# EAGLE design PCB-SSB-1x2 (EAGLE 7.1.0)
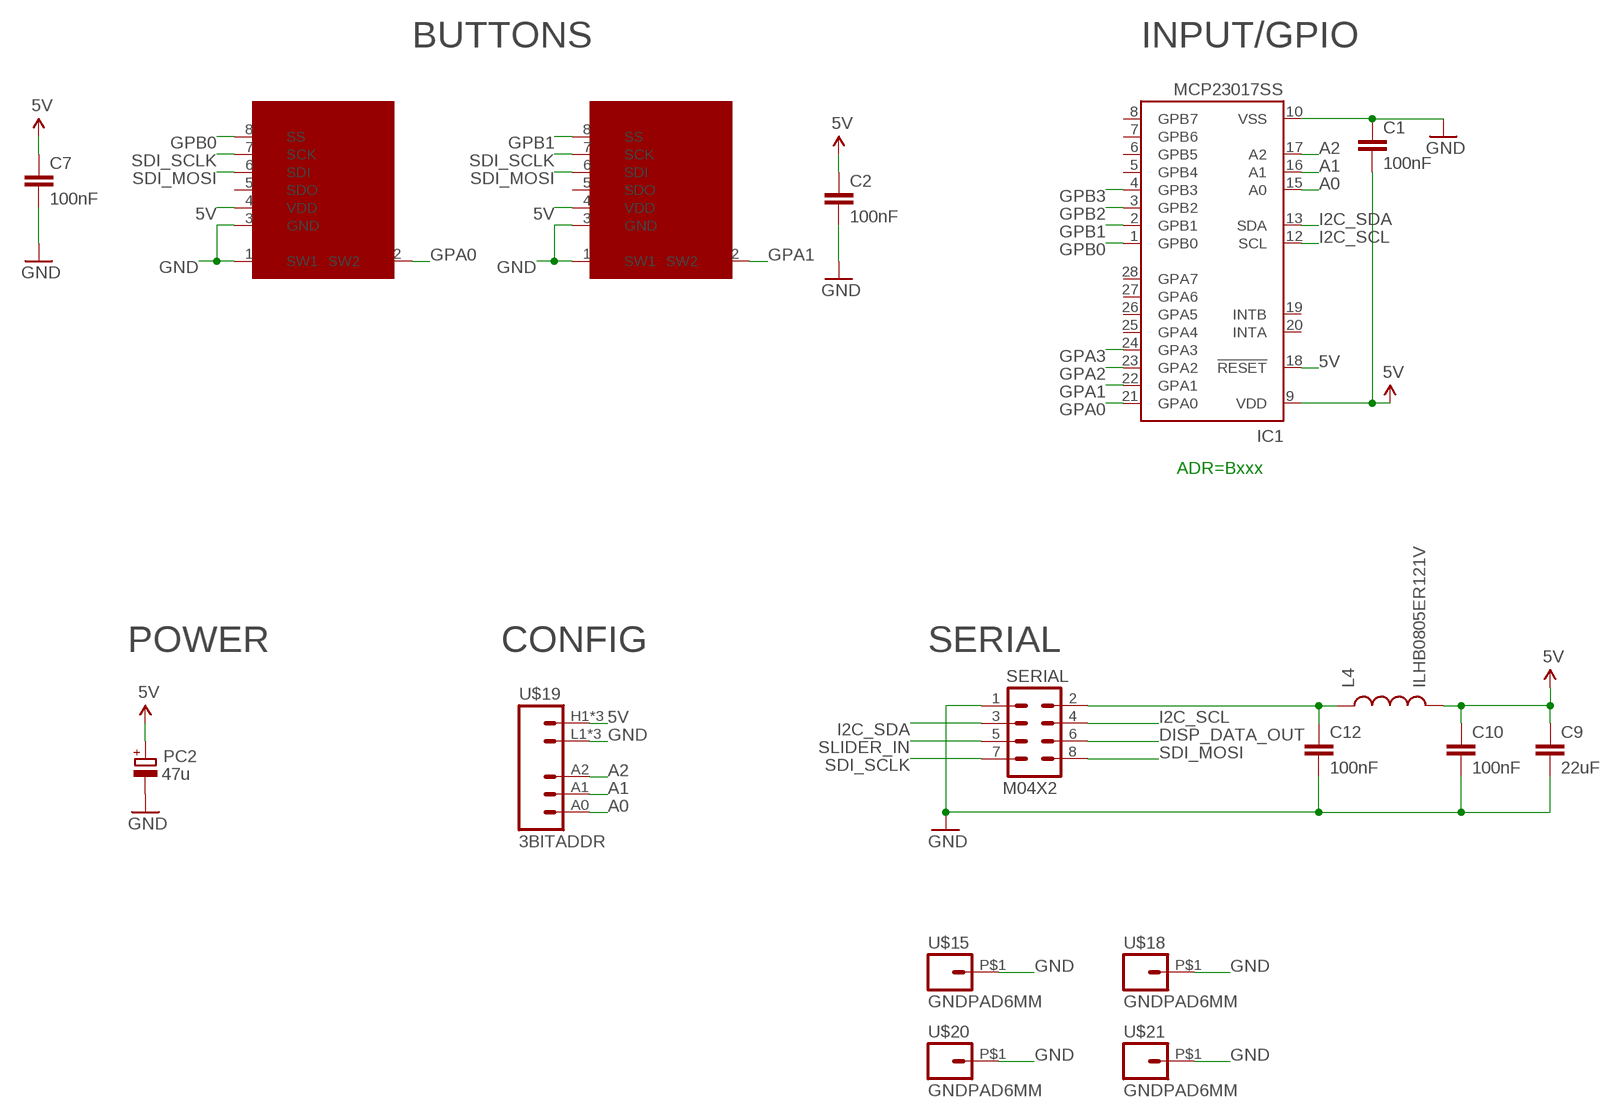
[diagram p0: schematic, sheet 1]

## Parts
C1  100nF  CAP0603-CAP  [0603-CAP]
C2  100nF  CAP0603-CAP  [0603-CAP]
C7  100nF  CAP0603-CAP  [0603-CAP]
C9  22uF  CAP0805  [0805]
C10  100nF  CAP0603-CAP  [0603-CAP]
C12  100nF  CAP0603-CAP  [0603-CAP]
IC1  MCP23017SS  [SSOP28]
L4  ILHB0805ER121V  INDUCTOR0805  [0805]
PC2  47u  CPOL-EUD  [PANASONIC_D]
SERIAL  M04X2  [2X4]
SSW1  SMART_SWITCHSMART_SWITCH_8PIN  [SMART_SWITCH]
SSW2  SMART_SWITCHSMART_SWITCH_8PIN  [SMART_SWITCH]
U$15  GNDPAD6MM  [3.2MMPAD6MM]
U$18  GNDPAD6MM  [3.2MMPAD6MM]
U$19  3BITADDR  [3BITADDR]
U$20  GNDPAD6MM  [3.2MMPAD6MM]
U$21  GNDPAD6MM  [3.2MMPAD6MM]

## Nets
5V [Power]: C1.2 C2.1 C7.1 C9.1 C10.1 IC1.9(VDD) IC1.18(!RESET) L4.2 PC2.+ SSW1.4(VDD) SSW2.4(VDD) U$19.H1(VCC) U$19.H2(VCC) U$19.H3(VCC)
A0: IC1.15(A0) U$19.A0
A1: IC1.16(A1) U$19.A1
A2: IC1.17(A2) U$19.A2
ARD_5V [Power]: C12.1 L4.1 SERIAL.2
DISP_DATA_OUT: SERIAL.6
GND [Power]: C1.1 C2.2 C7.2 C9.2 C10.2 C12.2 IC1.10(VSS) PC2.- SERIAL.1 SSW1.1(SW1) SSW1.3(GND) SSW2.1(SW1) SSW2.3(GND) U$15.P$1 U$18.P$1 U$19.L1(GND) U$19.L2(GND) U$19.L3(GND) U$20.P$1 U$21.P$1
GPA0: IC1.21(GPA0) SSW1.2(SW2)
GPA1: IC1.22(GPA1) SSW2.2(SW2)
GPA2: IC1.23(GPA2)
GPA3: IC1.24(GPA3)
GPB0: IC1.1(GPB0) SSW1.8(SS)
GPB1: IC1.2(GPB1) SSW2.8(SS)
GPB2: IC1.3(GPB2)
GPB3: IC1.4(GPB3)
I2C_SCL: IC1.12(SCL) SERIAL.4
I2C_SDA: IC1.13(SDA) SERIAL.3
SDI_MOSI: SERIAL.8 SSW1.6(SDI) SSW2.6(SDI)
SDI_SCLK: SERIAL.7 SSW1.7(SCK) SSW2.7(SCK)
SLIDER_IN: SERIAL.5
Unconnected: IC1.5(GPB4) IC1.6(GPB5) IC1.7(GPB6) IC1.8(GPB7) IC1.19(INTB) IC1.20(INTA) IC1.25(GPA4) IC1.26(GPA5) IC1.27(GPA6) IC1.28(GPA7) SSW1.5(SDO) SSW2.5(SDO)

## Notes on the sheet
- BUTTONS | INPUT/GPIO
- ADR=Bxxx
- POWER | CONFIG | SERIAL

## Library data of the parts
C1 C2 C7 C9 C10 C12 = SparkFun:CAP: Capacitor Standard 0603 ceramic capacitor, and 0.1" leaded capacitor.
IC1 = microchip:MCP23017: http://ww1.microchip.com/downloads/en/DeviceDoc/21952a.pdf Source: http://ww1.microchip.com/downloads/en/DeviceDoc/21952a.pdf; MF: MICROCHIP; MPN: MCP23017-E/SS; OC_FARNELL: 1467674; OC_NEWARK: 31K2960
L4 = SparkFun:INDUCTOR: Inductors Basic Inductor/Choke - 0603 and 1206. Footprints are not proven and vary greatly between part numbers.
PC2 = rcl:CPOL-EU: POLARIZED CAPACITOR, European symbol
SERIAL = SparkFun:M04X2
SSW1 SSW2 = SKAARHOJ:SMART_SWITCH: SMARTSWITCH IS15DSBFP4RGB www.nkksmartswitch.com
U$15 U$18 U$20 U$21 = SKAARHOJ:GNDPAD
U$19 = SKAARHOJ:3BITADDR

## Net classes
0 default: width 0.203 mm, drill 0.406 mm, clearance 0.203 mm
1 Power: width 0.406 mm, drill 0.61 mm, clearance 0.203 mm

## Board
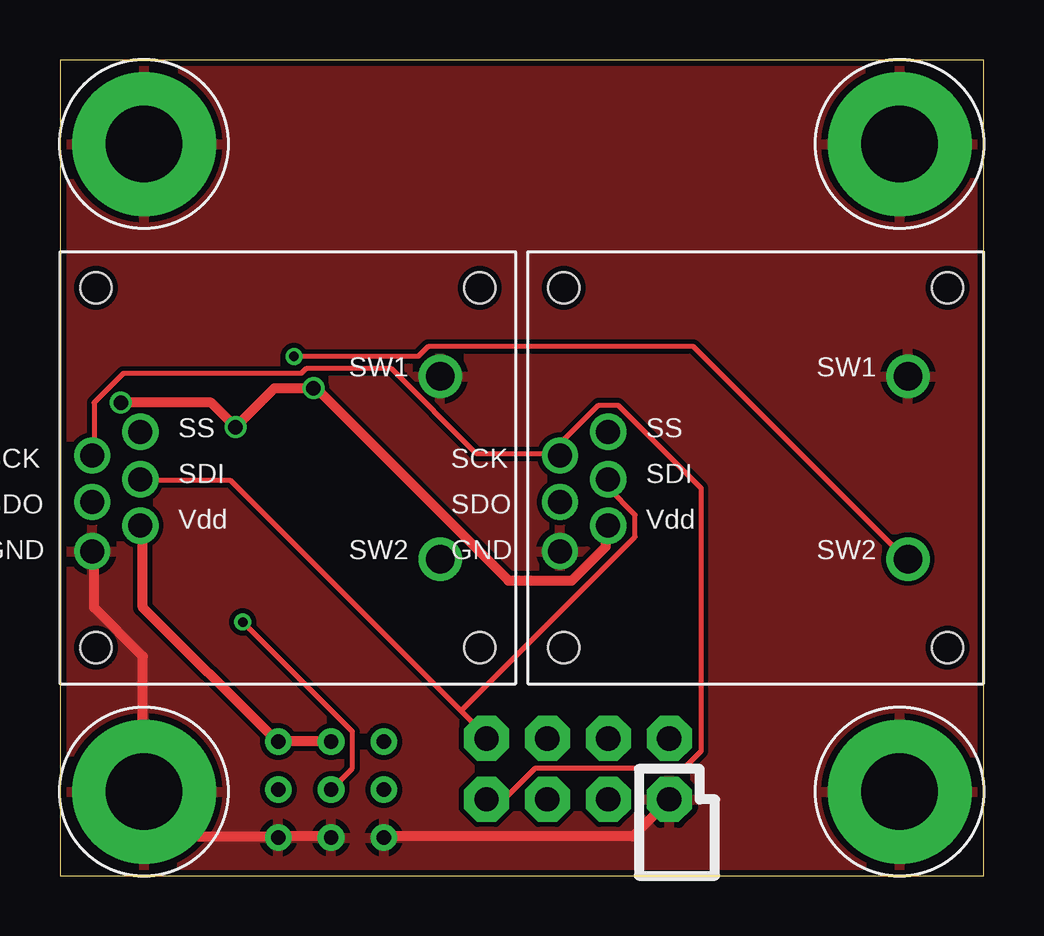
[diagram p1: board, top side]
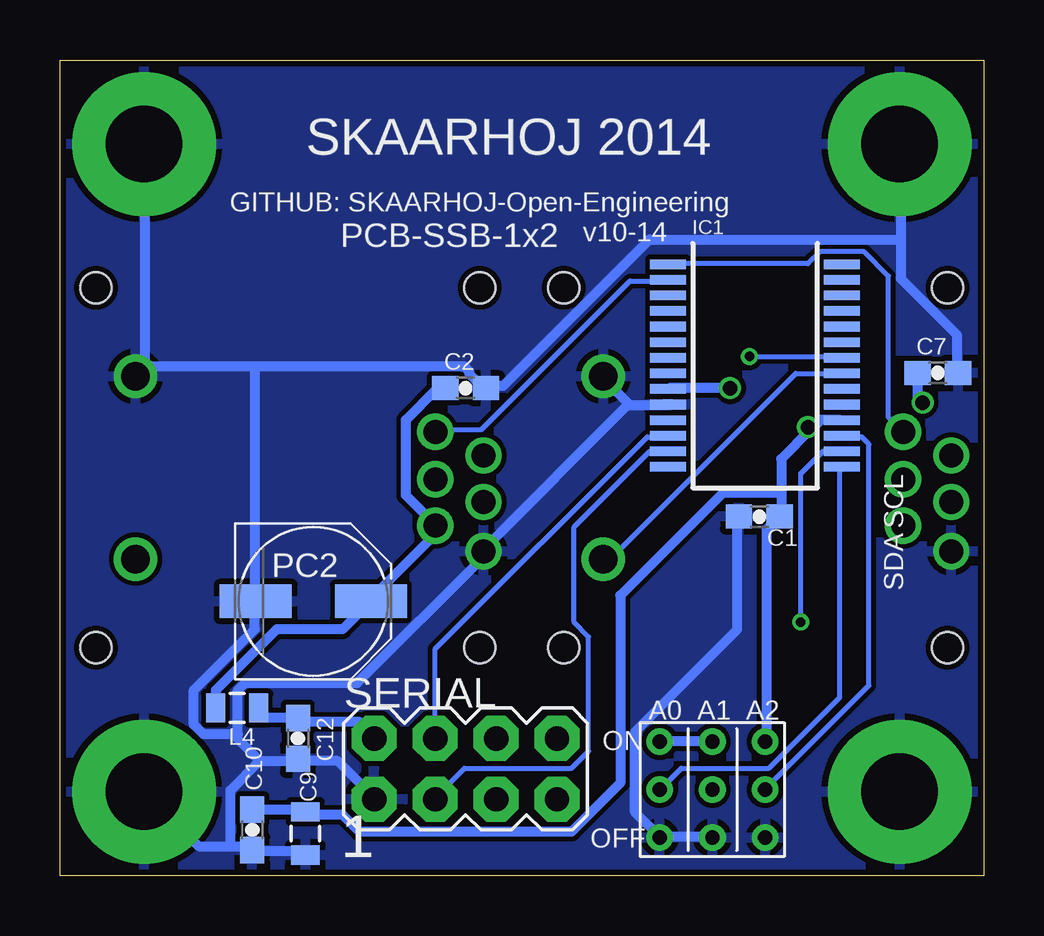
[diagram p2: board, bottom side, seen from below]

Size 38.5 x 34 mm. Coordinates in mm from the lower left corner, seen from the top.
Outline: 0,0 38.5,0 38.5,34 0,34 0,0
Copper layers (1*16): Top 0.035mm / dielectric 1.5mm / Bottom 0.035mm
Design rules "Fusion_eagle_rule_v1.1": minimum track width 6mil, minimum drill 12mil, track to track 6mil, track to pad 6mil, pad to pad 6mil, via to via 6mil, smd to smd 0mil, copper to edge 10mil, drill to drill 10mil, minimum pad ring 10mil, minimum via ring 6mil, stop-mask expansion 2mil, vias tented up to drill 100mil, thermal gap 10mil

### Footprints (pad centres in the part's own frame; a part is rotated, then mirrored left to right if it is on the bottom)
0603-CAP = smd 1.1 x 1: 1 -0.85,0; 2 0.85,0
0805 = smd 0.8 x 1.2: 1 -0.9,0; 2 0.9,0
SSOP28 = smd 0.4 x 1.5: 1 -4.225,-3.625; 2 -3.575,-3.625; 3 -2.925,-3.625; 4 -2.275,-3.625; 5 -1.625,-3.625; 6 -0.975,-3.625; 7 -0.325,-3.625; 8 0.325,-3.625; 9 0.975,-3.625; 10 1.625,-3.625; 11 2.275,-3.625; 12 2.925,-3.625; 13 3.575,-3.625; 14 4.225,-3.625; 15 4.225,3.625; 16 3.575,3.625; 17 2.925,3.625; 18 2.275,3.625; 19 1.625,3.625; 20 0.975,3.625; 21 0.325,3.625; 22 -0.325,3.625; 23 -0.975,3.625; 24 -1.625,3.625; 25 -2.275,3.625; 26 -2.925,3.625; 27 -3.575,3.625; 28 -4.225,3.625
PANASONIC_D = smd 3 x 1.4: + 2.4,0; - -2.4,0
2X4 = drill 1.016 pad 1.88 octagon: 1 -3.81,-1.27; 2 -3.81,1.27; 3 -1.27,-1.27; 4 -1.27,1.27; 5 1.27,-1.27; 6 1.27,1.27; 7 3.81,-1.27; 8 3.81,1.27
SMART_SWITCH = drill 1.2: 1 6.35,3.81; 2 6.35,-3.81 | drill 1: 3 -8.153,-3.48; 4 -6.147,-2.413; 5 -8.153,-1.422; 6 -6.147,-0.483; 7 -8.153,0.508; 8 -6.147,1.499 | hole 1.3: -8.001,7.506; 8.001,7.506; 8.001,-7.506; -8.001,-7.506
3.2MMPAD6MM = drill 3.2 pad 6: P$1 0,0
3BITADDR = drill 0.6: A0 -2.2,0; A1 0,0; A2 2.2,0; H1 -2.2,2; H2 0,2; H3 2.2,2; L1 -2.2,-2; L2 0,-2; L3 2.2,-2

### Placement (x,y rotation side)
C1  9.35,14.96 0 bottom
C2  21.59,20.32 0 bottom
C7  1.91,20.95 0 bottom
C9  28.27,1.75 270 bottom
C10  30.48,1.91 270 bottom
C12  28.57,5.71 270 bottom
IC1  9.53,21.26 270 bottom
L4  31.11,6.99 180 bottom
PC2  27.94,11.43 0 bottom
SERIAL  21.59,4.45 0 bottom
SSW1  9.5,17 0 top
SSW2  29,17 0 top
U$15  3.5,3.5 0 top
U$18  35,3.5 0 top
U$19  11.3,3.58 0 bottom
U$20  3.5,30.5 0 top
U$21  35,30.5 0 top

### Tracks (layer width: path | path; a pad name or v marks a point on that pad's centre or on a via)
5V  (via drill 0.61)
  Top 0.406: U$19.H2 11.28,5.59 9.14,5.59 U$19.H3 8.94,5.69 3.45,11.18 3.45,14.53 SSW1.4 | v2.54,19.71 6.3,19.71 v7.32,18.69 8.94,20.32 v10.57,20.32 10.67,20.32 18.69,12.29 21.34,12.29 22.76,13.72 22.76,14.53 SSW2.4
  Bottom 0.406: C2.1 22.76,20.32 24.08,19 24.08,15.85 22.86,14.63 SSW2.4 22.96,14.43 22.96,14.12 25.5,11.58 PC2.+ 25.6,11.38 26.72,10.26 29.46,10.26 32,7.72 32,7.01 L4.2 | U$19.H1 13.41,5.59 11.38,5.59 U$19.H2 | C10.1 28.35,2.74 C9.1 28.14,2.54 26.72,2.54 26.01,1.83 17.17,1.83 15.14,3.86 15.14,11.68 10.87,15.95 8.43,15.95 | 8.43,15.95 8.43,17.37 7.21,18.59 | 8.43,15.95 8.43,15.04 C1.2 8.64,14.83 9.04,14.43 9.04,5.59 U$19.H3 | 7.21,18.59 6.81,19 5.99,19 IC1.18 | v2.54,19.71 2.74,19.91 2.74,20.93 C7.1 | v7.32,18.69 7.21,18.59 | v10.57,20.32 13.11,20.32 IC1.9
A0
  Bottom 0.203: IC1.15 5.99,16.97 5.99,7.42 8.94,4.47 12.6,4.47 13.41,3.66 U$19.A0
A1  (via drill 0.41)
  Top 0.203: v7.62,10.57 12.19,5.99 12.19,4.47 U$19.A1
  Bottom 0.203: v7.62,10.57 7.62,16.76 6.71,17.68 5.99,17.68 IC1.16
A2
  Bottom 0.203: IC1.17 5.89,18.29 5.08,18.29 4.78,17.98 4.78,7.92 9.04,3.66 U$19.A2
ARD_5V
  Bottom 0.406: L4.1 30.18,6.91 29.87,6.6 28.65,6.6 C12.1 28.45,6.4 26.01,6.4 25.4,5.79 SERIAL.2
GND
  Top 0.406: U$19.L2 11.28,1.63 9.14,1.63 U$19.L3 8.94,1.63 5.49,1.63 3.66,3.45 U$15.P$1 3.45,3.56 3.45,9.14 1.42,11.18 1.42,13.51 SSW1.3 | U$19.L1 13.51,1.63 23.88,1.63 25.4,3.15 SERIAL.1
  Bottom 0.406: C1.1 10.26,14.94 10.26,10.26 14.53,5.99 14.53,2.64 13.51,1.63 U$19.L1 13.31,1.63 11.38,1.63 U$19.L2 | 3.45,26.52 3.45,30.48 U$20.P$1 | 3.45,26.52 3.45,24.89 1.12,22.55 1.12,21.03 C7.2 | 30.38,21.23 34.85,21.23 35.26,20.83 SSW2.1 34.95,21.34 34.95,30.48 U$21.P$1 | 30.38,21.23 21.64,21.23 21.44,21.03 21.44,20.93 20.83,20.32 C2.2 20.62,20.42 20.02,20.42 13.92,26.52 3.45,26.52 | 30.38,21.23 30.38,11.48 PC2.- 30.38,11.28 30.38,10.26 32.92,7.72 32.92,6.3 32.51,5.89 31.09,5.89 | 14.73,19.61 13.21,19.61 IC1.10 | 14.73,19.61 15.85,20.73 SSW1.1 | 14.73,19.61 14.83,19.61 20.83,13.61 SSW2.3 20.83,13.31 26.11,8.03 30.79,8.03 31.09,7.72 31.09,5.89 | SERIAL.1 25.4,3.25 26.92,4.78 28.55,4.78 C12.2 28.75,4.78 30.18,4.78 | C9.2 28.35,0.91 28.45,1.02 30.48,1.02 C10.2 30.58,1.22 31.39,1.22 | 31.39,1.22 32.72,1.22 34.95,3.45 U$18.P$1 | 30.18,4.78 31.39,3.56 31.39,1.22 | 31.09,5.89 31.09,5.69 30.18,4.78
  pour Top: 0,0 38.73,0 38.73,34.29 0,34.29
  pour Bottom: 0,0 38.73,0 38.73,34.29 0,34.29
GPA0
  Bottom 0.203: IC1.21 5.99,20.93 7.82,20.93 15.54,13.21 15.85,13.21 SSW1.2
GPA1  (via drill 0.41)
  Top 0.203: v9.75,21.64 14.94,21.64 15.34,22.05 26.42,22.05 35.26,13.21 SSW2.2
  Bottom 0.203: v9.75,21.64 5.99,21.64 IC1.22
GPB0
  Bottom 0.203: IC1.1 13.11,25.5 7.32,25.5 6.81,26.01 4.98,26.01 3.96,24.99 3.96,19.1 3.45,18.59 SSW1.8
GPB1
  Bottom 0.203: IC1.2 13.21,24.79 14.73,24.79 20.93,18.59 22.76,18.59 SSW2.8
I2C_SCL
  Bottom 0.203: SERIAL.4 22.86,9.45 14.02,18.29 13.21,18.29 IC1.12
I2C_SDA
  Bottom 0.203: IC1.13 13.21,17.68 13.92,17.68 17.07,14.53 17.07,10.57 16.46,9.96 16.46,5.18 17.17,4.47 21.64,4.47 22.86,3.25 SERIAL.3
SDI_MOSI
  Top 0.203: 16.71,6.86 17.78,5.79 SERIAL.8 | 16.71,6.86 7.11,16.46 3.45,16.46 SSW1.6 | 16.71,6.86 23.98,14.12 23.98,15.04 22.86,16.15 22.86,16.46 SSW2.6
SDI_SCLK
  Top 0.203: SSW1.7 1.42,17.58 1.42,19.71 2.64,20.93 10.06,20.93 10.26,21.13 13.82,21.13 17.37,17.58 20.83,17.58 SSW2.7 20.83,17.68 20.83,17.98 22.45,19.61 23.27,19.61 26.72,16.15 26.72,5.18 26.01,4.47 19.81,4.47 18.59,3.25 17.78,3.25 SERIAL.7

### Text on the board
_bsilk: SKAARHOJ 2014 | GITHUB: SKAARHOJ-Open-Engineering | v10-14 | PCB-SSB-1x2 | SCL | SDA | 1